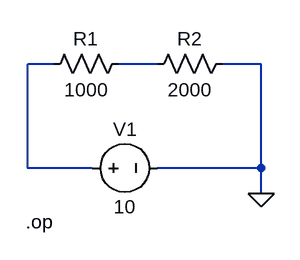
[diagram p0: schematic 2 resistenze.asc]
2 resistenze.asc, the LTspice schematic file:
Version 4
SHEET 1 880 680
WIRE 80 112 48 112
WIRE 208 112 160 112
WIRE 336 112 288 112
WIRE 48 240 48 112
WIRE 128 240 48 240
WIRE 336 240 336 112
WIRE 336 240 208 240
WIRE 336 272 336 240
FLAG 336 272 0
SYMBOL res 176 96 R90
WINDOW 0 0 56 VBottom 2
WINDOW 3 32 56 VTop 2
SYMATTR InstName R1
SYMATTR Value 1000
SYMBOL res 304 96 R90
WINDOW 0 0 56 VBottom 2
WINDOW 3 32 56 VTop 2
SYMATTR InstName R2
SYMATTR Value 2000
SYMBOL voltage 112 240 R270
WINDOW 0 32 56 VTop 2
WINDOW 3 -32 56 VBottom 2
WINDOW 123 0 0 Left 0
WINDOW 39 0 0 Left 0
SYMATTR InstName V1
SYMATTR Value 10
TEXT 46 306 Left 2 !.op

The netlist it stands for:
* 2 resistenze.asc
R1 N002 N001 1000
R2 0 N002 2000
V1 N001 0 10
.op
.backanno
.end